# Altium project SWDAdaptor.PrjPcb
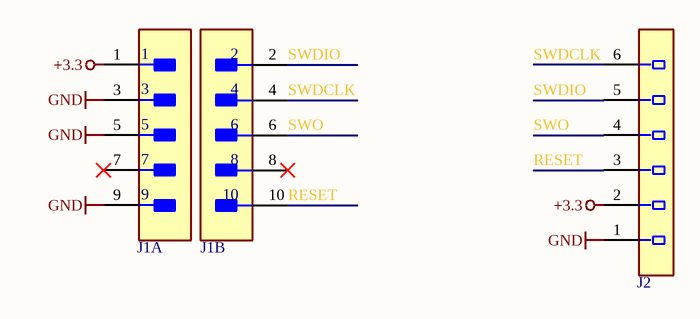
[diagram p0: Sheet1.SchDoc]
1 sheet, 2 parts. Net scope: global (net labels, ports and power ports of the same name join across sheets).
Board file: PCB1.PcbDoc

## Sheet Sheet1.SchDoc
size A

### Parts
J1  Connector 10 pin  [Amphenol_ICC_-_FCI_0_MFG]  (value not drawn)  (parts A,B of 2)
J2  Connector  [DS1013-6]  (value not drawn)

### Nets
+3.3: J1.1 J2.2
GND: J1.3 J1.5 J1.9 J2.1
RESET: J1.10 J2.3
SWDCLK: J1.4 J2.6
SWDIO: J1.2 J2.5
SWO: J1.6 J2.4

Not connected (* = marked no-connect by the designer): J1 7* 8*

### Library data of the parts
J1 = Connector 10 pin: Part Number: 20021121-00010C4LF
J2 = Connector 6 pin